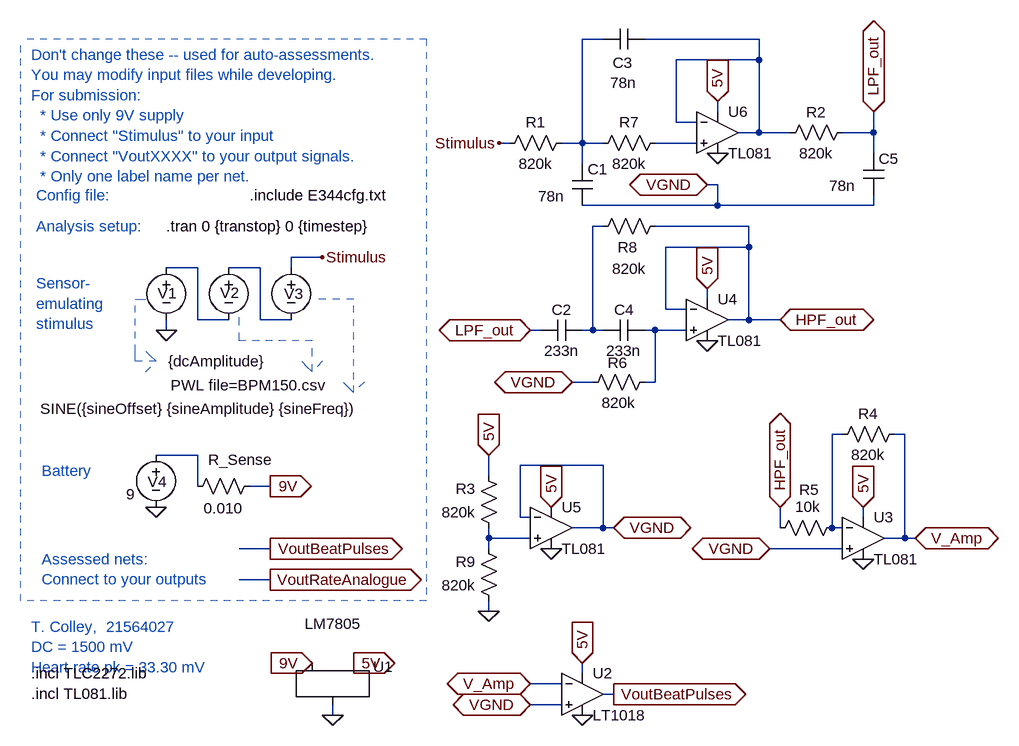
[diagram p0: schematic Colley_21564027_A2.asc]
Colley_21564027_A2.asc, the LTspice schematic file:
Version 4
SHEET 1 1824 680
WIRE -1408 -1408 -1440 -1408
WIRE -1168 -1408 -1344 -1408
WIRE -1168 -1376 -1168 -1408
WIRE -1168 -1376 -1296 -1376
WIRE -1232 -1296 -1232 -1312
WIRE -1296 -1280 -1296 -1376
WIRE -1264 -1280 -1296 -1280
WIRE -1168 -1264 -1168 -1376
WIRE -1168 -1264 -1200 -1264
WIRE -1120 -1264 -1168 -1264
WIRE -992 -1264 -992 -1296
WIRE -992 -1264 -1040 -1264
WIRE -1552 -1248 -1568 -1248
WIRE -1440 -1248 -1440 -1408
WIRE -1440 -1248 -1472 -1248
WIRE -1408 -1248 -1440 -1248
WIRE -1264 -1248 -1328 -1248
WIRE -992 -1232 -992 -1264
WIRE -1440 -1216 -1440 -1248
WIRE -1232 -1184 -1248 -1184
WIRE -1232 -1152 -1232 -1184
WIRE -1232 -1152 -1440 -1152
WIRE -992 -1152 -992 -1168
WIRE -992 -1152 -1232 -1152
WIRE -1408 -1120 -1424 -1120
WIRE -1184 -1120 -1328 -1120
WIRE -1184 -1088 -1184 -1120
WIRE -1184 -1088 -1312 -1088
WIRE -1840 -1072 -1888 -1072
WIRE -2032 -1056 -2080 -1056
WIRE -1936 -1056 -1984 -1056
WIRE -1888 -1056 -1888 -1072
WIRE -1248 -1008 -1248 -1024
WIRE -1312 -992 -1312 -1088
WIRE -1280 -992 -1312 -992
WIRE -2032 -976 -2032 -1056
WIRE -1984 -976 -2032 -976
WIRE -1936 -976 -1936 -1056
WIRE -1888 -976 -1936 -976
WIRE -1184 -976 -1184 -1088
WIRE -1184 -976 -1216 -976
WIRE -1136 -976 -1184 -976
WIRE -2080 -960 -2080 -976
WIRE -1504 -960 -1520 -960
WIRE -1424 -960 -1424 -1120
WIRE -1424 -960 -1440 -960
WIRE -1408 -960 -1424 -960
WIRE -1328 -960 -1344 -960
WIRE -1280 -960 -1328 -960
WIRE -1424 -880 -1456 -880
WIRE -1328 -880 -1328 -960
WIRE -1328 -880 -1344 -880
WIRE -1040 -800 -1056 -800
WIRE -944 -800 -960 -800
WIRE -2032 -768 -2096 -768
WIRE -1408 -752 -1536 -752
WIRE -1584 -736 -1584 -768
WIRE -2032 -720 -2032 -768
WIRE -1920 -720 -1952 -720
WIRE -1536 -672 -1536 -752
WIRE -1520 -672 -1536 -672
WIRE -1008 -672 -1008 -688
WIRE -1408 -656 -1408 -752
WIRE -1408 -656 -1456 -656
WIRE -1392 -656 -1408 -656
WIRE -1136 -656 -1136 -688
WIRE -1056 -656 -1056 -800
WIRE -1040 -656 -1056 -656
WIRE -1584 -640 -1584 -656
WIRE -1520 -640 -1584 -640
WIRE -944 -640 -944 -800
WIRE -944 -640 -976 -640
WIRE -928 -640 -944 -640
WIRE -1920 -624 -1968 -624
WIRE -1584 -624 -1584 -640
WIRE -1040 -624 -1152 -624
WIRE -1920 -576 -1968 -576
WIRE -1584 -528 -1584 -544
WIRE -1440 -432 -1440 -448
WIRE -1472 -416 -1520 -416
WIRE -1392 -400 -1408 -400
WIRE -1472 -384 -1520 -384
WIRE -1824 -368 -1824 -384
FLAG -2080 -960 0
FLAG -1840 -1072 Stimulus
FLAG -1920 -720 9V
IOPIN -1920 -720 Out
FLAG -2096 -688 0
FLAG -1856 -448 9V
IOPIN -1856 -448 In
FLAG -1920 -624 VoutBeatPulses
IOPIN -1920 -624 Out
FLAG -1568 -1248 Stimulus
FLAG -1920 -576 VoutRateAnalogue
IOPIN -1920 -576 Out
FLAG -1392 -400 VoutBeatPulses
IOPIN -1392 -400 Out
FLAG -1824 -368 0
FLAG -1792 -448 5V
IOPIN -1792 -448 Out
FLAG -992 -1296 LPF_out
IOPIN -992 -1296 BiDir
FLAG -1136 -688 HPF_out
IOPIN -1136 -688 BiDir
FLAG -1232 -1232 0
FLAG -1232 -1312 5V
IOPIN -1232 -1312 In
FLAG -1008 -608 0
FLAG -1008 -688 5V
IOPIN -1008 -688 In
FLAG -1136 -976 HPF_out
IOPIN -1136 -976 BiDir
FLAG -1248 -944 0
FLAG -1248 -1024 5V
IOPIN -1248 -1024 In
FLAG -1520 -960 LPF_out
IOPIN -1520 -960 BiDir
FLAG -928 -640 V_Amp
IOPIN -928 -640 BiDir
FLAG -1440 -448 5V
IOPIN -1440 -448 In
FLAG -1520 -416 V_Amp
IOPIN -1520 -416 BiDir
FLAG -1440 -368 0
FLAG -1584 -768 5V
IOPIN -1584 -768 In
FLAG -1584 -528 0
FLAG -1392 -656 VGND
IOPIN -1392 -656 BiDir
FLAG -1248 -1184 VGND
IOPIN -1248 -1184 BiDir
FLAG -1488 -624 0
FLAG -1488 -688 5V
IOPIN -1488 -688 In
FLAG -1152 -624 VGND
IOPIN -1152 -624 BiDir
FLAG -1456 -880 VGND
IOPIN -1456 -880 BiDir
FLAG -1520 -384 VGND
IOPIN -1520 -384 BiDir
SYMBOL voltage -1984 -1072 R0
WINDOW 123 0 0 Left 0
WINDOW 39 0 0 Left 0
WINDOW 3 -89 197 Left 2
WINDOW 0 -13 54 Left 2
SYMATTR Value PWL file=BPM150.csv
SYMATTR InstName V2
SYMBOL voltage -1888 -1072 R0
WINDOW 123 24 44 Left 2
WINDOW 39 0 0 Left 0
WINDOW 3 -386 233 Left 2
WINDOW 0 -11 56 Left 2
SYMATTR Value SINE({sineOffset} {sineAmplitude} {sineFreq})
SYMATTR InstName V3
SYMBOL voltage -2080 -1072 R0
WINDOW 123 0 0 Left 0
WINDOW 39 0 0 Left 0
WINDOW 3 3 160 Left 2
WINDOW 0 -13 55 Left 2
SYMATTR Value {dcAmplitude}
SYMATTR InstName V1
SYMBOL voltage -2096 -784 R0
WINDOW 123 24 44 Left 2
WINDOW 39 0 0 Left 0
WINDOW 3 -46 76 Left 2
WINDOW 0 -13 57 Left 2
SYMATTR Value 9
SYMATTR InstName V4
SYMBOL res -1936 -736 R90
WINDOW 0 -9 30 VBottom 2
WINDOW 3 34 56 VTop 2
SYMATTR InstName R_Sense
SYMATTR Value 0.010
SYMBOL LM7805 -1824 -432 R0
WINDOW 3 1 -92 Top 2
SYMATTR InstName U1
SYMBOL res -1456 -1264 R90
WINDOW 0 0 56 VBottom 2
WINDOW 3 32 56 VTop 2
SYMATTR InstName R1
SYMATTR Value 820k
SYMBOL cap -1456 -1216 R0
WINDOW 3 -52 50 Left 2
SYMATTR Value 78n
SYMATTR InstName C1
SYMBOL res -944 -816 R90
WINDOW 0 0 56 VBottom 2
WINDOW 3 32 56 VTop 2
SYMATTR InstName R4
SYMATTR Value 820k
SYMBOL res -1040 -672 R90
WINDOW 0 -27 51 VBottom 2
WINDOW 3 -32 53 VTop 2
SYMATTR InstName R5
SYMATTR Value 10k
SYMBOL res -1440 -864 R270
WINDOW 0 30 54 VTop 2
WINDOW 3 0 56 VBottom 2
SYMATTR InstName R6
SYMATTR Value 820k
SYMBOL cap -1440 -976 R90
WINDOW 0 0 32 VBottom 2
WINDOW 3 32 32 VTop 2
SYMATTR InstName C2
SYMATTR Value 233n
SYMBOL res -1312 -1264 R90
WINDOW 0 0 56 VBottom 2
WINDOW 3 32 56 VTop 2
SYMATTR InstName R7
SYMATTR Value 820k
SYMBOL cap -1344 -1424 R90
WINDOW 0 68 34 VBottom 2
WINDOW 3 68 33 VTop 2
SYMATTR InstName C3
SYMATTR Value 78n
SYMBOL cap -1344 -976 R90
WINDOW 0 0 32 VBottom 2
WINDOW 3 32 32 VTop 2
SYMATTR InstName C4
SYMATTR Value 233n
SYMBOL res -1424 -1104 R270
WINDOW 0 -32 54 VTop 2
WINDOW 3 -34 56 VBottom 2
SYMATTR InstName R8
SYMATTR Value 820k
SYMBOL Comparators/LT1018 -1440 -400 R0
SYMATTR InstName U2
SYMBOL Opamps/opamp2 -1008 -704 R0
SYMATTR InstName U3
SYMATTR Value TL081
SYMBOL res -1024 -1280 R90
WINDOW 0 0 56 VBottom 2
WINDOW 3 32 56 VTop 2
SYMATTR InstName R2
SYMATTR Value 820k
SYMBOL cap -1008 -1232 R0
WINDOW 3 -52 50 Left 2
SYMATTR Value 78n
SYMATTR InstName C5
SYMBOL res -1568 -640 R180
WINDOW 0 36 76 Left 2
WINDOW 3 36 40 Left 2
SYMATTR InstName R3
SYMATTR Value 820k
SYMBOL res -1568 -528 R180
WINDOW 0 36 76 Left 2
WINDOW 3 36 40 Left 2
SYMATTR InstName R9
SYMATTR Value 820k
SYMBOL Opamps/opamp2 -1232 -1328 R0
SYMATTR InstName U6
SYMATTR Value TL081
SYMBOL Opamps/opamp2 -1248 -1040 R0
SYMATTR InstName U4
SYMATTR Value TL081
SYMBOL Opamps/opamp2 -1488 -720 R0
SYMATTR InstName U5
SYMATTR Value TL081
TEXT -2080 -1120 Left 2 !.tran 0 {transtop} 0 {timestep}
TEXT -1952 -1168 Left 2 !.include E344cfg.txt
TEXT -2288 -1384 Left 2 ;Don't change these -- used for auto-assessments.\nYou may modify input files while developing.\nFor submission: \n  * Use only 9V supply \n  * Connect "Stimulus" to your input\n  * Connect "VoutXXXX" to your output signals.\n  * Only one label name per net.
TEXT -2280 -1168 Left 2 ;Config file:
TEXT -2280 -1120 Left 2 ;Analysis setup:
TEXT -2272 -744 Left 2 ;Battery
TEXT -2280 -1032 Left 2 ;Sensor-\nemulating \nstimulus
TEXT -2272 -608 Left 2 ;Assessed nets:\nConnect to your outputs
TEXT -2288 -504 Left 2 ;T. Colley,  21564027\nDC = 1500 mV\nHeart rate pk = 33.30 mV
TEXT -2288 -432 Left 2 !.incl TLC2272.lib\n.incl TL081.lib
LINE Normal -1792 -1008 -1856 -1008 2
LINE Normal -1792 -864 -1792 -1008 2
LINE Normal -1808 -880 -1792 -864 2
LINE Normal -1792 -864 -1808 -880 2
LINE Normal -1776 -880 -1792 -864 2
LINE Normal -2128 -1008 -2112 -1008 2
LINE Normal -2128 -928 -2128 -1008 2
LINE Normal -2128 -912 -2128 -928 2
LINE Normal -2096 -912 -2128 -912 2
LINE Normal -2112 -928 -2096 -912 2
LINE Normal -2096 -912 -2112 -928 2
LINE Normal -2112 -896 -2096 -912 2
LINE Normal -1968 -944 -1968 -992 2
LINE Normal -1856 -944 -1968 -944 2
LINE Normal -1856 -896 -1856 -944 2
LINE Normal -1872 -912 -1856 -896 2
LINE Normal -1856 -896 -1872 -912 2
LINE Normal -1840 -912 -1856 -896 2
LINE Normal -2304 -544 -2304 -1408 1
LINE Normal -1680 -1408 -1680 -544 1
LINE Normal -1680 -544 -2304 -544 1
LINE Normal -1680 -1408 -2304 -1408 1

The netlist it stands for:
* Colley_21564027_A2.asc
V2 N006 N005 PWL file=BPM150.csv
V3 Stimulus N006 SINE({sineOffset} {sineAmplitude} {sineFreq})
V1 N005 0 {dcAmplitude}
V4 N009 0 9
R_Sense 9V N009 0.010
XU1 9V 0 5V LM7805
R1 N001 Stimulus 820k
C1 N001 VGND 78n
R4 V_Amp N008 820k
R5 N008 HPF_out 10k
R6 VGND N007 820k
C2 N004 LPF_out 233n
R7 N003 N001 820k
C3 N002 N001 78n
C4 N007 N004 233n
R8 N004 HPF_out 820k
XU2 VGND V_Amp 5V 0 VoutBeatPulses LT1018  ; pins In+ In- V+ V- OUT
XU3 VGND N008 5V 0 V_Amp TL081  ; pins In+ In- V+ V- OUT
R2 LPF_out N002 820k
C5 LPF_out VGND 78n
R3 N010 5V 820k
R9 0 N010 820k
XU6 N003 N002 5V 0 N002 TL081  ; pins In+ In- V+ V- OUT
XU4 N007 HPF_out 5V 0 HPF_out TL081  ; pins In+ In- V+ V- OUT
XU5 N010 VGND 5V 0 VGND TL081  ; pins In+ In- V+ V- OUT
.tran 0 {transtop} 0 {timestep}
.include E344cfg.txt
* Don't change these -- used for auto-assessments.
* You may modify input files while developing.
* For submission:
*   * Use only 9V supply
*   * Connect "Stimulus" to your input
*   * Connect "VoutXXXX" to your output signals.
*   * Only one label name per net.
* Config file:
* Analysis setup:
* Battery
* Sensor-
* emulating
* stimulus
* Assessed nets:
* Connect to your outputs
* T. Colley,  21564027
* DC = 1500 mV
* Heart rate pk = 33.30 mV
.incl TLC2272.lib
.incl TL081.lib
.lib LTC1.lib
.backanno
.end